# EAGLE design marquee-power-PCB (EAGLE 9.5.2)
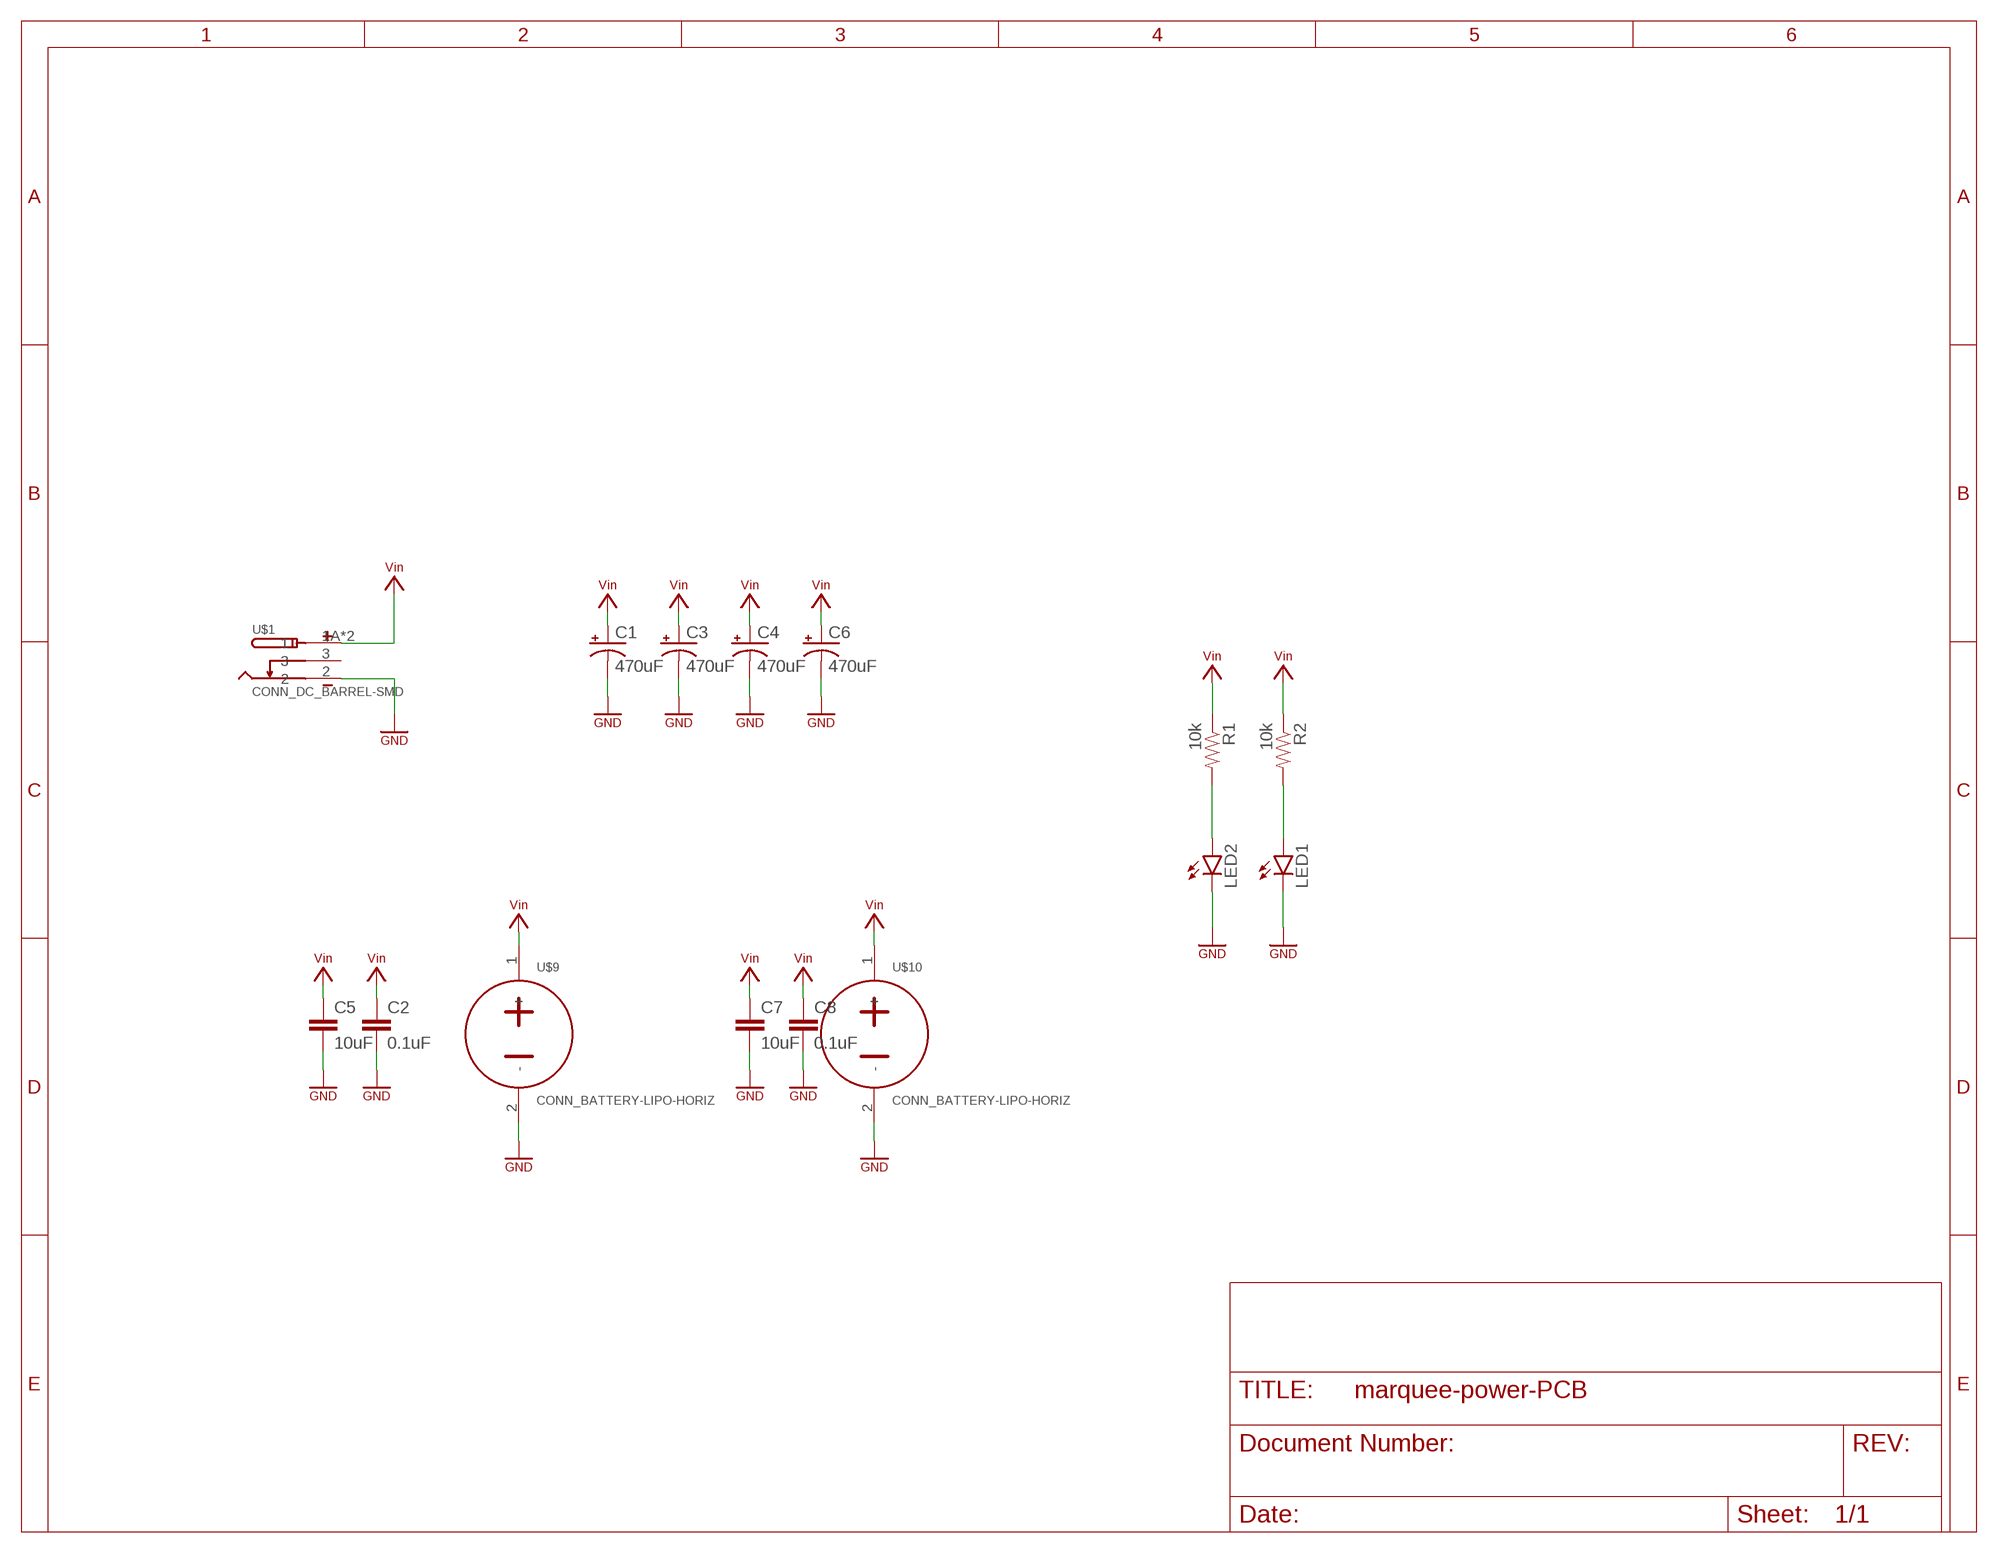
[diagram p0: schematic, sheet 1]

## Parts
C1  470uF  COMPONENT_CAP_POL-10MM  [CAP_RADIAL_CAN_10MM]
C2  0.1uF  COMPONENT_CAP-0805  [0805]
C3  470uF  COMPONENT_CAP_POL-10MM  [CAP_RADIAL_CAN_10MM]
C4  470uF  COMPONENT_CAP_POL-10MM  [CAP_RADIAL_CAN_10MM]
C5  10uF  COMPONENT_CAP-0805  [0805]
C6  470uF  COMPONENT_CAP_POL-10MM  [CAP_RADIAL_CAN_10MM]
C7  10uF  COMPONENT_CAP-0805  [0805]
C8  0.1uF  COMPONENT_CAP-0805  [0805]
LED1  LED-0805  [CHIP-LED0805]
LED2  LED-0805  [CHIP-LED0805]
R1  10k  COMPONENT_RESISTOR-0805  [0805]
R2  10k  COMPONENT_RESISTOR-0805  [0805]
U$1  CONN_DC_BARREL-SMD  [694106106102]
U$9  CONN_BATTERY-LIPO-HORIZ  [JST-PH-2-SMT-RA]
U$10  CONN_BATTERY-LIPO-HORIZ  [JST-PH-2-SMT-RA]

## Nets
GND: C1.- C2.2 C3.- C4.- C5.2 C6.- C7.2 C8.2 LED1.C LED2.C U$1.2 U$9.2(-) U$10.2(-) ; supply symbol labelled SYMBOL_GND
N$1: LED2.A R1.2
N$2: LED1.A R2.2
VIN: C1.+ C2.1 C3.+ C4.+ C5.1 C6.+ C7.1 C8.1 R1.1 R2.1 U$1.1A U$1.1B U$9.1(+) U$10.1(+) ; supply symbol labelled SYMBOL_VIN
Unconnected: U$1.3

## Library data of the parts
C1 C3 C4 C6 = homemade-hardware:COMPONENT_CAP_POL: Capacitor Polarized These are standard SMD and PTH capacitors. Normally 47uF, 100uF, and 470uF in electrolytic and tantalum varieties. Always verify the external diameter of the through hole cap, it varies with capacity, voltage, and manufacturer. The EIA devices should be standard.
C2 C5 C7 C8 = homemade-hardware:COMPONENT_CAP: Capacitor Standard 0603 ceramic capacitor, and 0.1" leaded capacitor.
LED1 LED2 = homemade-hardware:LED: LEDs Standard schematic elements and footprints for 5mm, 3mm, 1206, and 0603 sized LEDs. 5mm - Spark Fun Electronics SKU : COM-00529 (and others)
R1 R2 = homemade-hardware:COMPONENT_RESISTOR
U$1 = homemade-hardware:CONN_DC_BARREL: 694106106102 <https://www.digikey.com/products/en/connectors-interconnects/barrel-power-connectors/435?k=694106106102&k=&pkeyword=694106106102&sv=0&pv7=2&sf=0&quantity=&ColumnSort=0&page=1&pageSize=25>: SMD DC Barrel (OD=5.5mm, ID=2mm)
U$9 U$10 = homemade-hardware:CONN_BATTERY

## Board
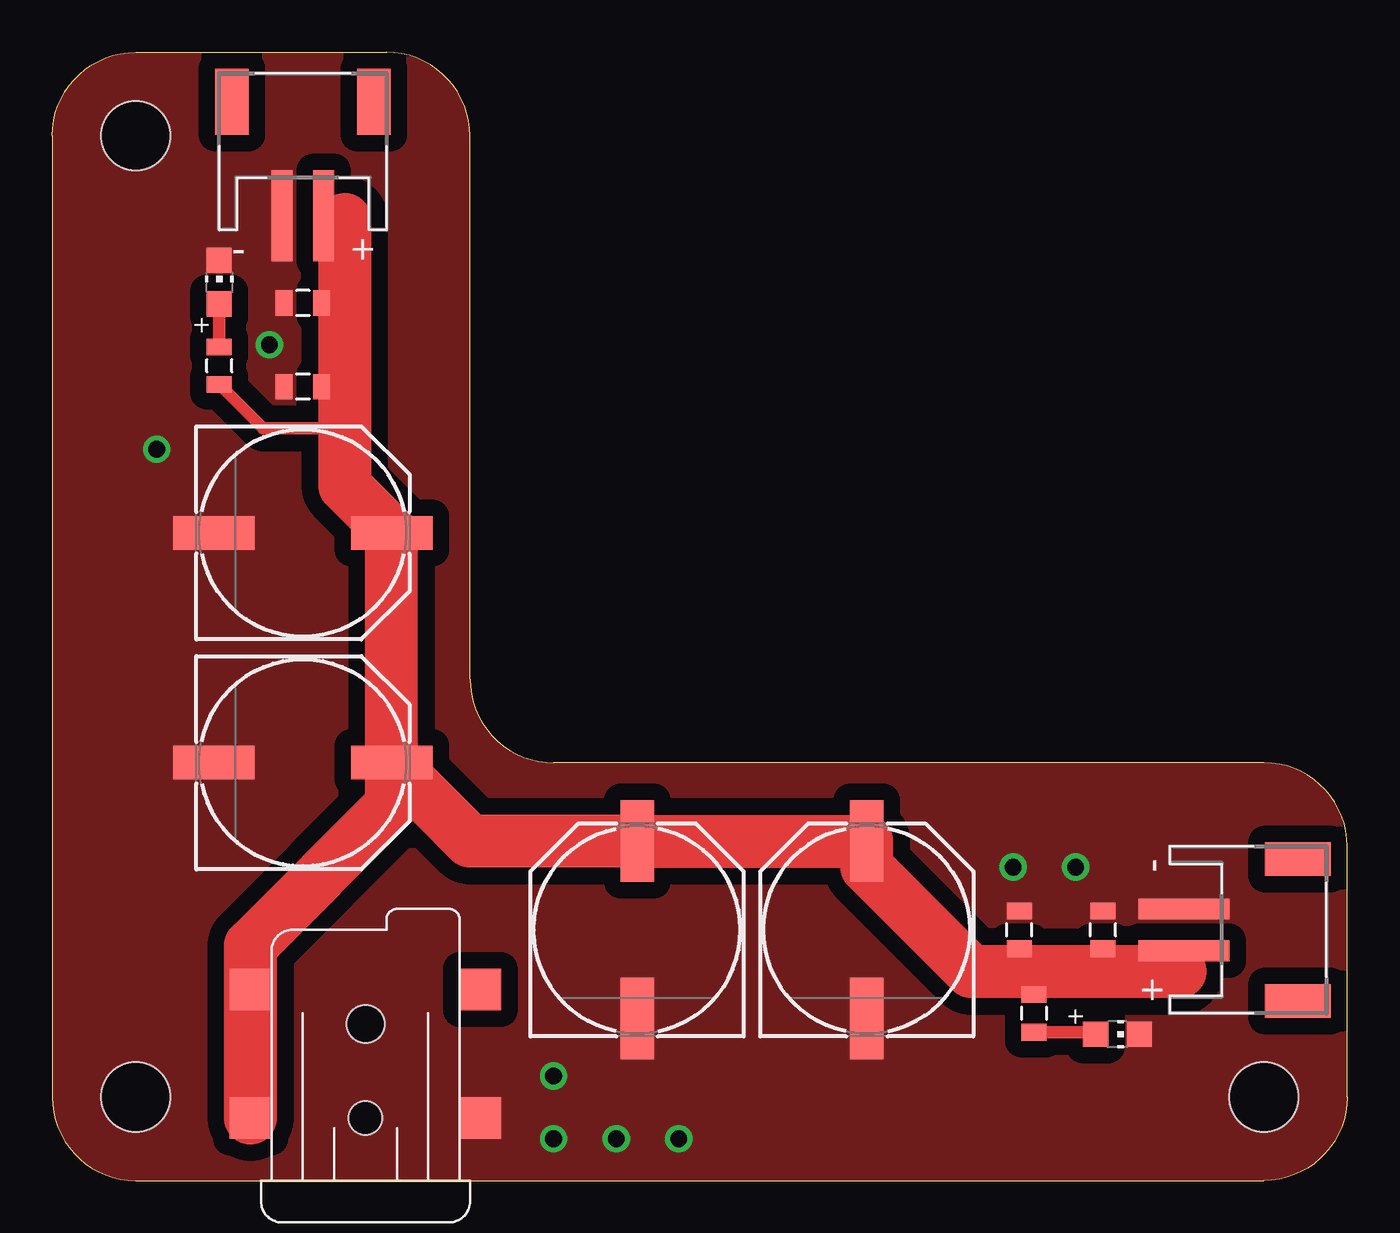
[diagram p1: board, top side]
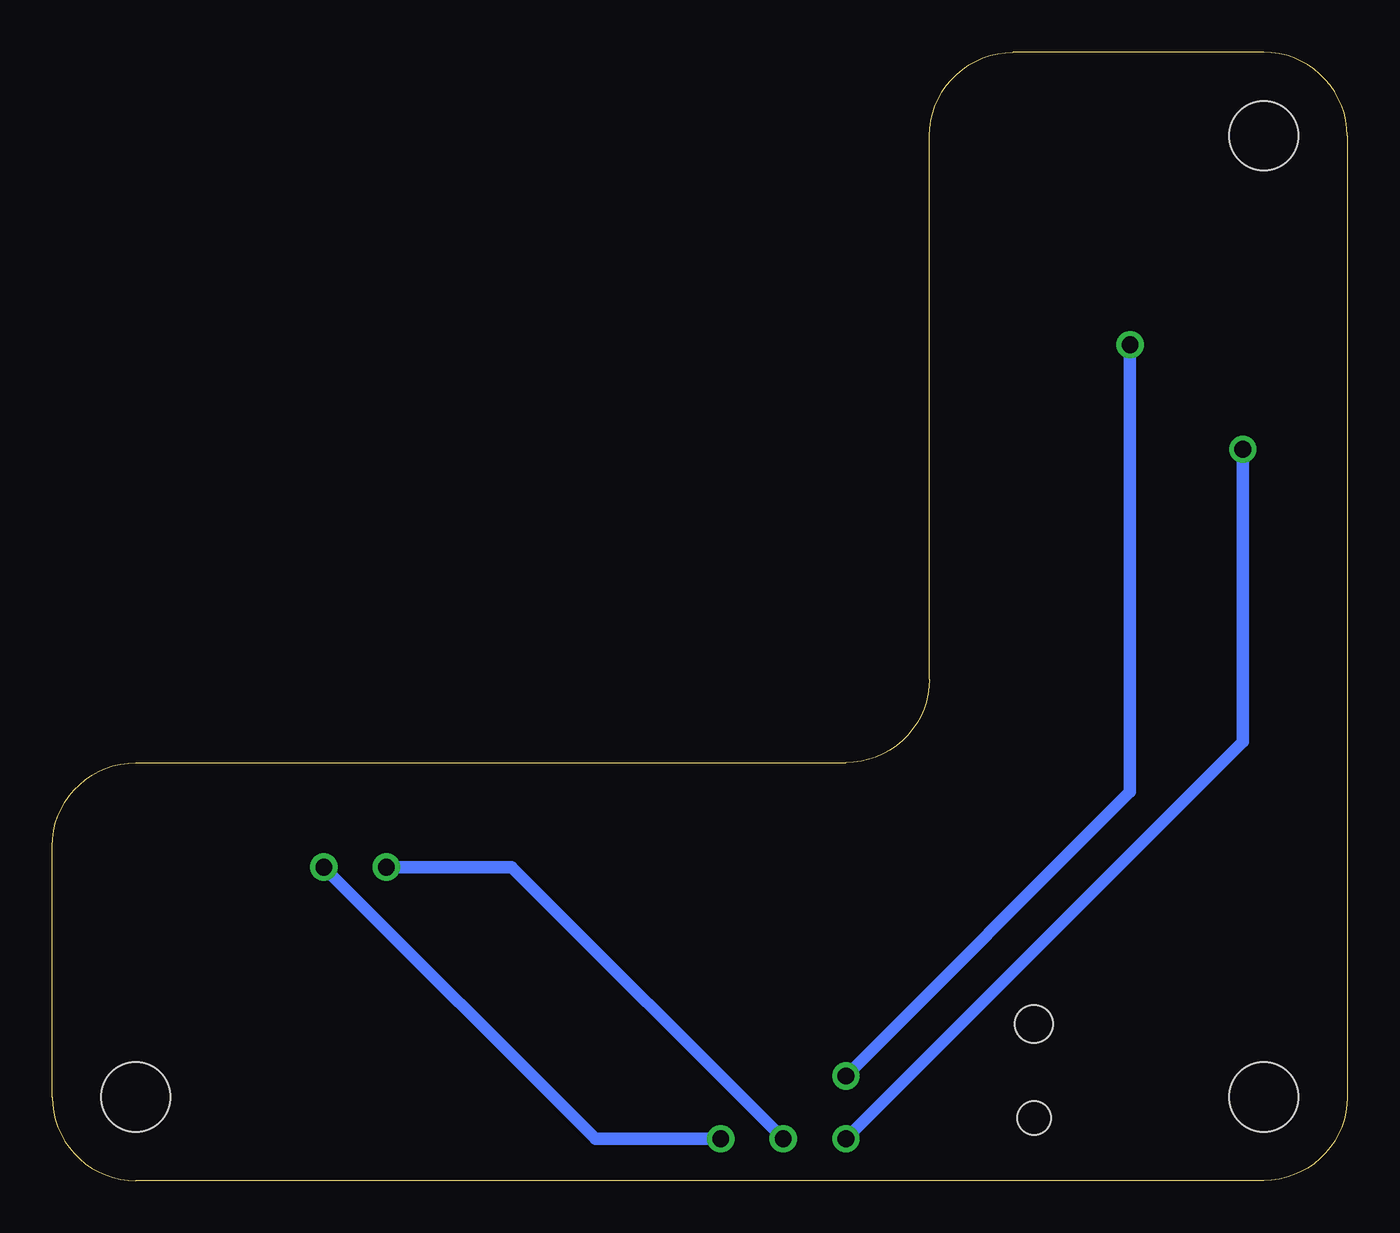
[diagram p2: board, bottom side, seen from below]

Size 62 x 54 mm. Coordinates in mm from the lower left corner, seen from the top.
Outline: 4,0 58,0 arc90 62,4 62,16 arc90 58,20 24,20 arc-90 20,24 20,50 arc90 16,54 4,54 arc90 0,50 0,4 arc90 4,0
Copper layers (1*16): Top 0.035mm / dielectric 1.5mm / Bottom 0.035mm
Design rules "Endmill-1-32-Bantam": minimum track width 16mil, minimum drill 0.8mm, track to track 0.8mm, track to pad 0.8mm, pad to pad 0.8mm, via to via 0.8mm, smd to smd 0mil, copper to edge 1mil, drill to drill 1mil, minimum pad ring 10mil, minimum via ring 10mil, stop-mask expansion 1mil, vias tented up to drill 30mil, thermal gap 10mil
Holes 3.3 mm at 58,4 4,50 4,4

### Footprints (pad centres in the part's own frame; a part is rotated, then mirrored left to right if it is on the bottom)
CAP_RADIAL_CAN_10MM = smd 3.9 x 1.6: + 4.25,0; - -4.25,0
0805 = smd 0.8 x 1.2: 1 -0.9,0; 2 0.9,0
CHIP-LED0805 = smd 1.2 x 1.2: A 0,-1.05; C 0,1.05
694106106102 = smd 2 x 2: 1A 6.15,5.5; 1B 0,5.5; 2 0,-5.5; 3 6.15,-5.5 | hole 1.6: 0,0 | hole 1.8: 4.5,0
JST-PH-2-SMT-RA = smd 1 x 4.35: 1 1,-3.825; 2 -1,-3.825 | smd 1.6 x 3.15: NC1 -3.4,1.625; NC2 3.4,1.625

### Placement (x,y rotation side)
C1  28,12 90 top
C2  50.3,12 90 top
C3  12,20 0 top
C4  39,12 90 top
C5  46.3,12 90 top
C6  12,31 0 top
C7  12,38 180 top
C8  12,42 180 top
LED1  8,43 0 top
LED2  51,7 270 top
R1  47,8 270 top
R2  8,39 90 top
U$1  15,3 90 top
U$9  12,50 0 top
U$10  58,12 270 top

### Tracks (layer width: path | path; a pad name or v marks a point on that pad's centre or on a via)
GND  (via drill 0.8)
  Bottom 0.61: v24,2 5,21 v5,35 | v10.4,40 10.4,18.6 v24,5 | v30,2 36,2 v49,15 | v27,2 40,15 v46,15
  pour Top (no thermals): -1,55 21,55 21,24 24,21 63,21 63,-1 -1,-1
N$1
  Top 0.61: R1.2 49.95,7.1 LED2.A
N$2
  Top 0.61: LED1.A R2.2
VIN
  Top 0.406: C5.1 46,10.8 46,10 | U$10.1 54.17,9.82 54,10 | U$9.1 13.18,46 14,46 | C8.1 14,42 | C7.1 14,38 | C2.1 49.2,10 49,10
  Top 0.61: R2.1 10.1,36 14,36 | R1.1 46,9.9 46,10
  Top 2.54: U$1.1B U$1.1A 9.5,11.25 16.25,18 C3.+ | C3.+ C6.+ 14,33.25 14,36 14,38 14,42 14,46 | 49,10 46,10 44,10 39,15 C4.+ C1.+ 20,16.25 C3.+ | 54,10 49.2,10